# EAGLE design Lighting_Controller (EAGLE 9.6.2)
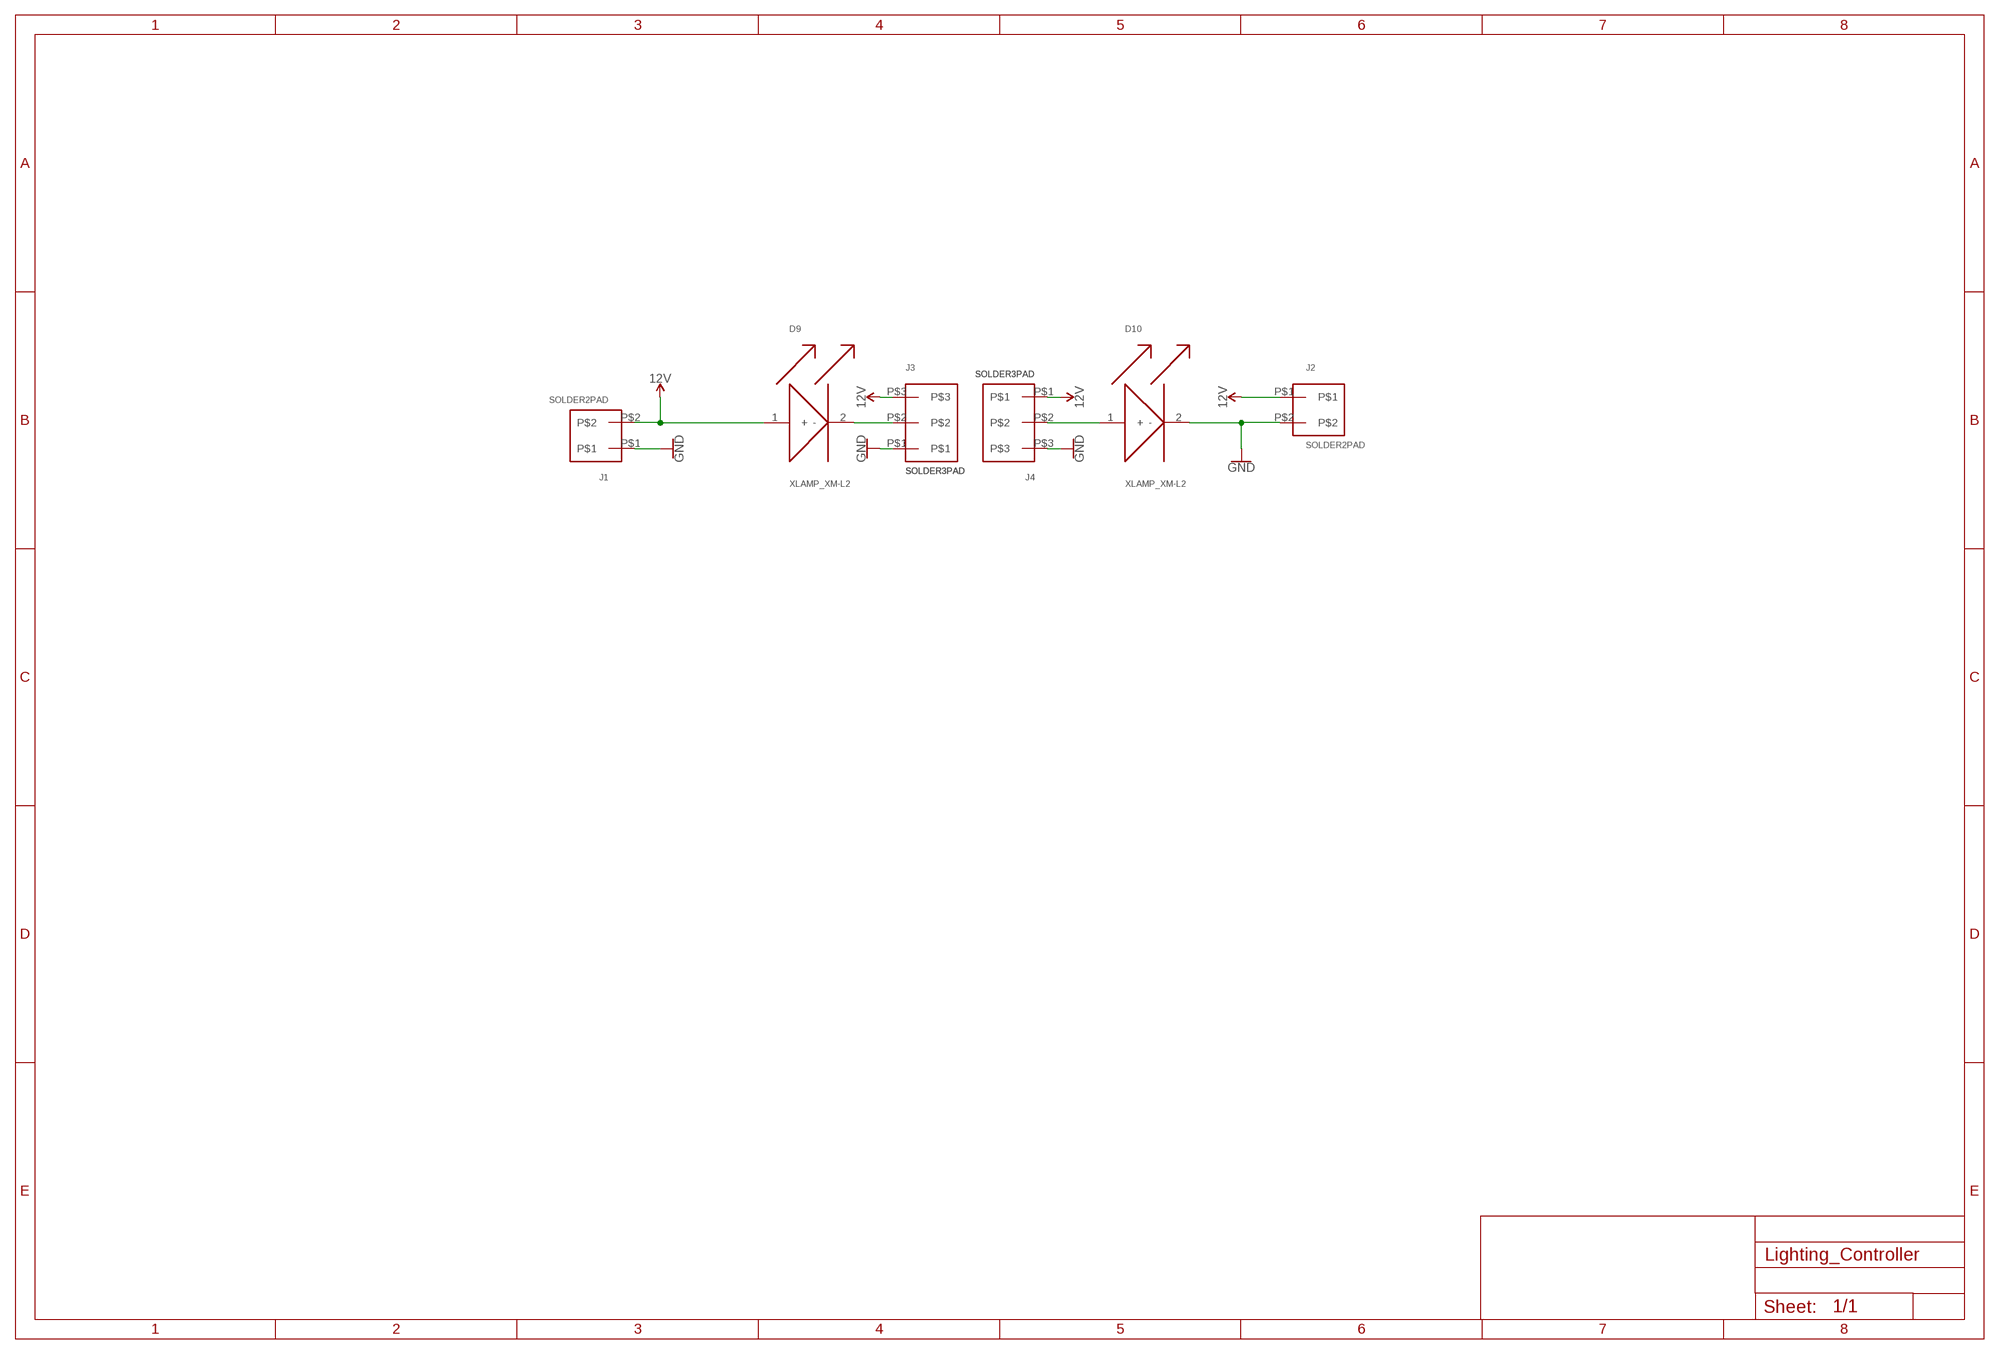
[diagram p0: schematic, sheet 1]

## Parts
D9  XLAMP_XM-L2  [XLAMP_XM-L2]
D10  XLAMP_XM-L2  [XLAMP_XM-L2]
J1  SOLDER2PAD  [SOLDER2PAD]
J2  SOLDER2PAD  [SOLDER2PAD]
J3  SOLDER3PAD  [SOLDER3PAD]
J4  SOLDER3PAD  [SOLDER3PAD]

## Nets
12V: D9.1(+) J1.P$2 J2.P$1 J3.P$3 J4.P$1
GND: D10.2(-) J1.P$1 J2.P$2 J3.P$1 J4.P$3
N$12: D10.1(+) J4.P$2
N$15: D9.2(-) J3.P$2

## Library data of the parts
D9 D10 = CreeXLamp_XM-L2:XLAMP_XM-L2
J1 J2 = Molex_0436500302:SOLDER2PAD
J3 J4 = Molex_0436500302:SOLDER3PAD

## Board
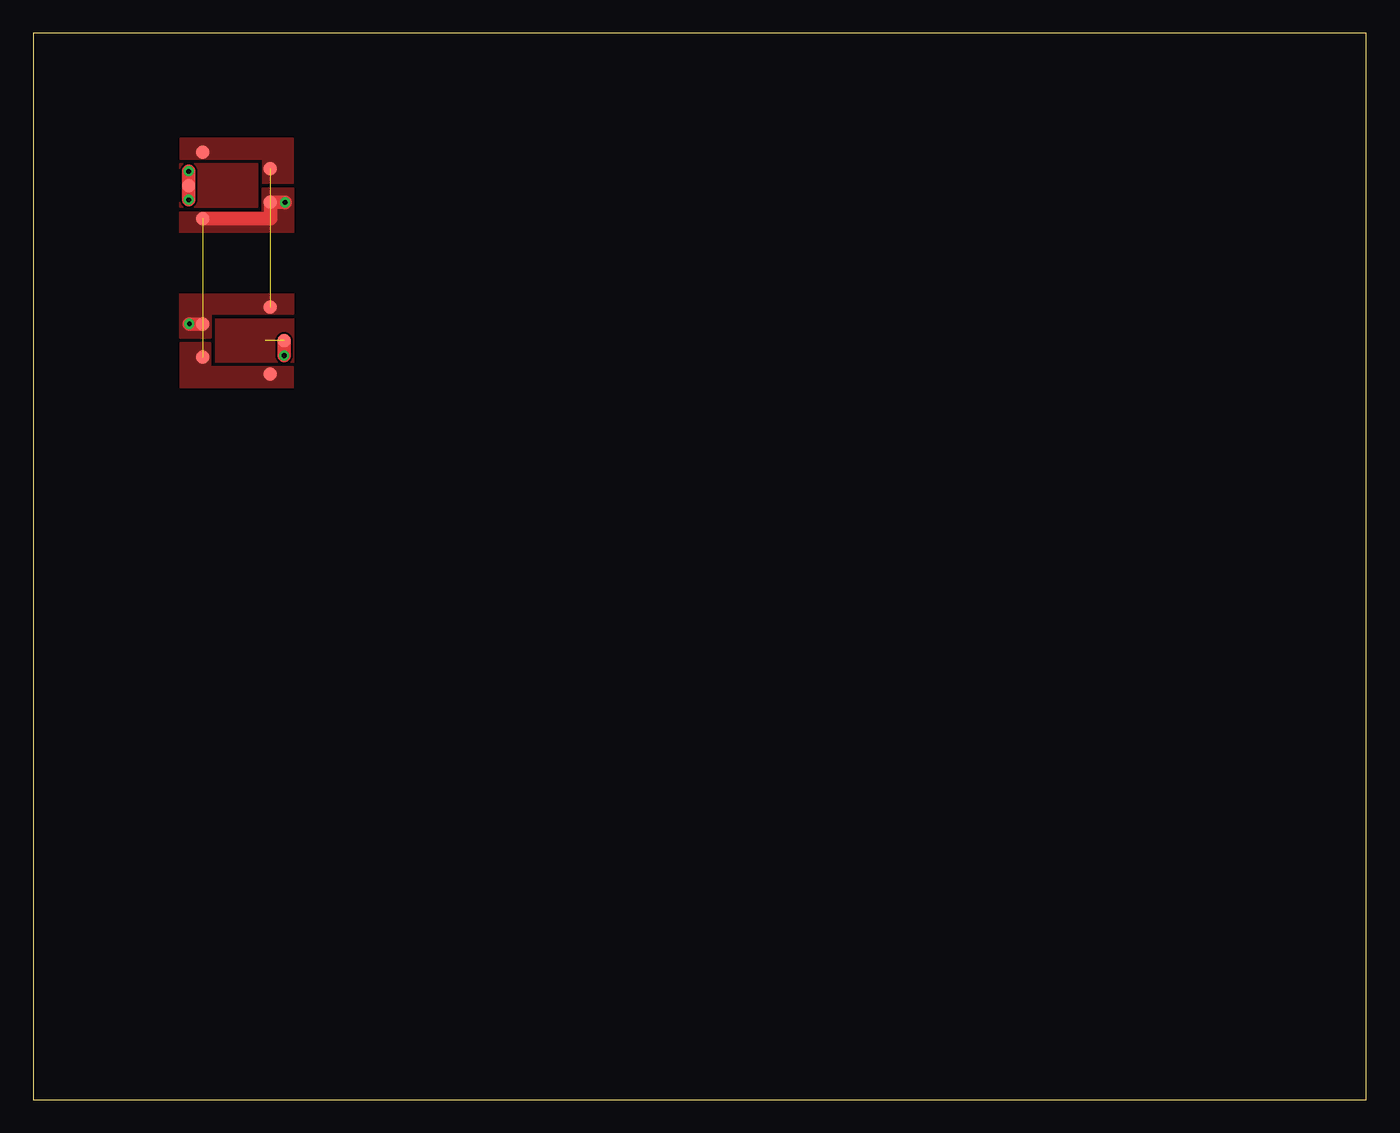
[diagram p1: board, top side]
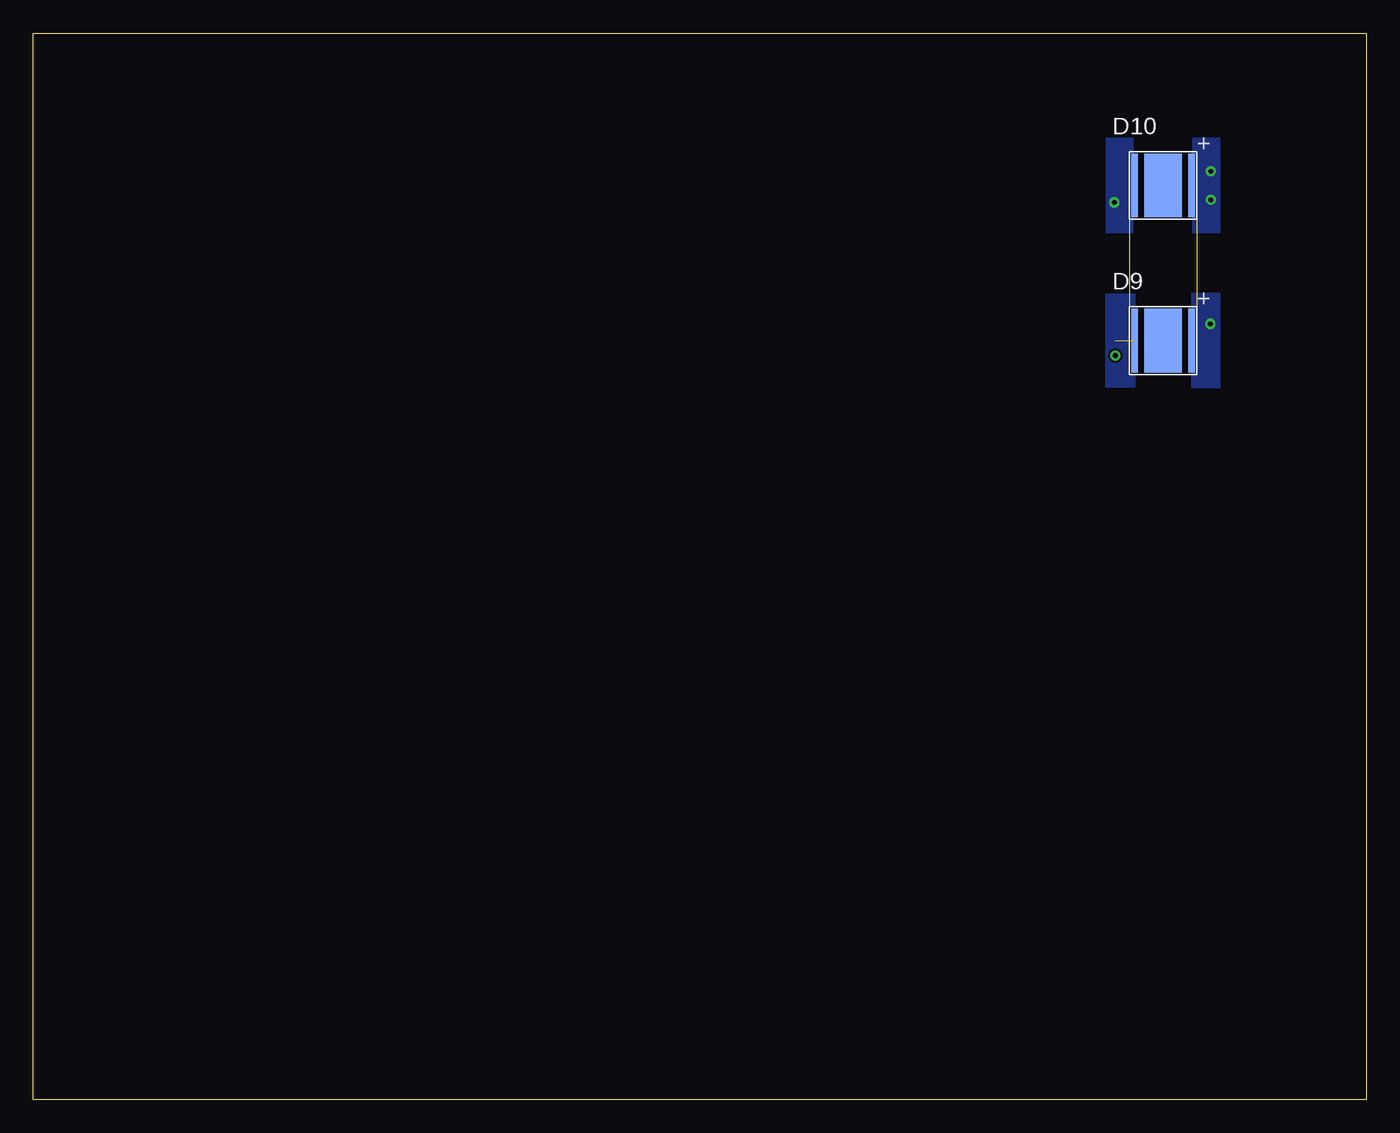
[diagram p2: board, bottom side, seen from below]

Size 100 x 80 mm. Coordinates in mm from the lower left corner, seen from the top.
Outline: 0,0 100,0 100,80 0,80 0,0
Copper layers (1*16): Top 0.035mm / dielectric 1.5mm / Bottom 0.035mm
Design rules "default": minimum track width 6mil, minimum drill 0.35mm, track to track 6mil, track to pad 6mil, pad to pad 6mil, via to via 6mil, smd to smd 6mil, copper to edge 40mil, drill to drill 6mil, minimum pad ring 10mil, minimum via ring 8mil, stop-mask expansion 4mil, vias tented up to drill 0mil, thermal gap 10mil

### Footprints (pad centres in the part's own frame; a part is rotated, then mirrored left to right if it is on the bottom)
XLAMP_XM-L2 = smd 0.5 x 4.78: 1 2.14,0; 2 -2.14,0 | smd 2.78 x 4.78: THERMAL 0,0
SOLDER2PAD = smd 1 x 1: P$1 -1.25,0; P$2 1.25,0
SOLDER3PAD = smd 1 x 1: P$1 -2.5,0; P$2 0,-1.036; P$3 2.5,0

### Placement (x,y rotation side)
D9  15.24,56.94 0 bottom
D10  15.24,68.58 0 bottom
J1  17.78,68.58 90 top
J2  12.7,56.94 270 top
J3  17.78,56.94 90 top
J4  12.7,68.58 270 top

### Tracks (layer width: path | path; a pad name or v marks a point on that pad's centre or on a via)
12V  (via drill 0.35)  (1 unrouted)
  Top 1: J2.P$1 v11.7,58.2
  pour Top (no thermals): 11,72.08 11,70.58 17.2,70.58 17.2,68.78 19.5,68.78 19.5,72.08
  pour Bottom (no thermals): 13.1,60.44 13.1,53.44 11,53.44 11,60.44
  pour Top (no thermals): 11,60.44 19.5,60.44 19.5,58.94 13.3,58.94 13.3,57.14 11,57.14
GND  (via drill 0.35)  (1 unrouted)
  Top 1: v18.9,67.31 18.88,67.33 J1.P$1 17.8,67.31 17.8,66.1 17.78,66.08 J4.P$3
  pour Bottom (no thermals): 17.5,72.08 19.5,72.08 19.5,65.08 17.5,65.08
  pour Top (no thermals): 11,65.08 11,66.58 17.2,66.58 17.2,68.38 19.5,68.38 19.5,65.08
  pour Top (no thermals): 19.5,54.94 13.3,54.94 13.3,56.74 11,56.74 11,53.44 19.5,53.44
N$12  (via drill 0.35)
  Top 1: v11.66,69.65 v11.66,69.64 J4.P$2 v11.66,67.52 v11.66,67.51
  pour Bottom (no thermals): 13,72.08 13,65.08 11,65.08 11,72.08
N$15  (via drill 0.35)  (1 unrouted)
  Top 1: J3.P$2 v18.82,55.83 v18.82,55.82
P$2
  pour Top: 11,70.2 16.8,70.2 16.8,66.96 11,66.96
  pour Bottom (no thermals): 17.4,60.44 17.4,53.44 19.5,53.44 19.5,60.44
  pour Top (no thermals): 19.5,58.56 19.5,55.32 13.7,55.32 13.7,58.56